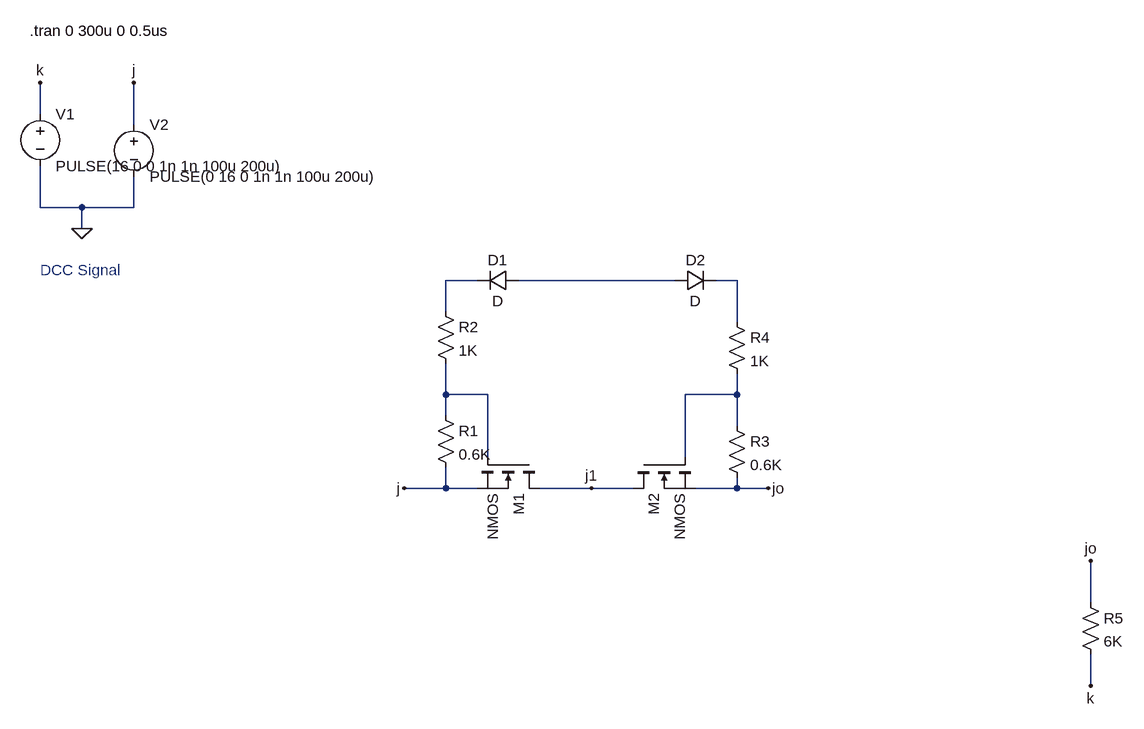
[diagram p0: schematic dccAbc.asc]
dccAbc.asc, the LTspice schematic file:
Version 4
SHEET 1 880 680
WIRE -1856 -688 -1856 -736
WIRE -1712 -672 -1712 -736
WIRE -1856 -544 -1856 -608
WIRE -1792 -544 -1856 -544
WIRE -1712 -544 -1712 -592
WIRE -1712 -544 -1792 -544
WIRE -1792 -512 -1792 -544
WIRE -1184 -432 -1232 -432
WIRE -880 -432 -1120 -432
WIRE -784 -432 -816 -432
WIRE -1232 -384 -1232 -432
WIRE -784 -368 -784 -432
WIRE -1232 -256 -1232 -304
WIRE -1168 -256 -1232 -256
WIRE -784 -256 -784 -288
WIRE -784 -256 -864 -256
WIRE -1232 -224 -1232 -256
WIRE -784 -208 -784 -256
WIRE -1168 -160 -1168 -256
WIRE -864 -160 -864 -256
WIRE -1232 -112 -1232 -144
WIRE -1232 -112 -1296 -112
WIRE -1184 -112 -1232 -112
WIRE -1008 -112 -1088 -112
WIRE -944 -112 -1008 -112
WIRE -784 -112 -784 -128
WIRE -784 -112 -848 -112
WIRE -736 -112 -784 -112
WIRE -240 64 -240 0
WIRE -240 192 -240 144
FLAG -1792 -512 0
FLAG -1712 -736 j
FLAG -1856 -736 k
FLAG -1296 -112 j
FLAG -1008 -112 j1
FLAG -736 -112 jo
FLAG -240 0 jo
FLAG -240 192 k
SYMBOL voltage -1712 -688 R0
SYMATTR InstName V2
SYMATTR Value PULSE(0 16 0 1n 1n 100u 200u)
SYMBOL voltage -1856 -704 R0
SYMATTR InstName V1
SYMATTR Value PULSE(16 0 0 1n 1n 100u 200u)
SYMBOL nmos -1088 -160 R90
SYMATTR InstName M1
SYMBOL nmos -944 -160 M90
SYMATTR InstName M2
SYMBOL res -1248 -240 R0
SYMATTR InstName R1
SYMATTR Value 0.6K
SYMBOL res -1248 -400 R0
SYMATTR InstName R2
SYMATTR Value 1K
SYMBOL res -800 -224 R0
SYMATTR InstName R3
SYMATTR Value 0.6K
SYMBOL res -800 -384 R0
SYMATTR InstName R4
SYMATTR Value 1K
SYMBOL diode -1120 -448 R90
WINDOW 0 0 32 VBottom 2
WINDOW 3 32 32 VTop 2
SYMATTR InstName D1
SYMBOL diode -880 -448 M90
WINDOW 0 0 32 VBottom 2
WINDOW 3 32 32 VTop 2
SYMATTR InstName D2
SYMBOL res -256 48 R0
SYMATTR InstName R5
SYMATTR Value 6K
TEXT -1872 -816 Left 2 !.tran 0 300u 0 0.5us
TEXT -1856 -448 Left 2 ;DCC Signal

The netlist it stands for:
* dccAbc.asc
V2 j 0 PULSE(0 16 0 1n 1n 100u 200u)
V1 k 0 PULSE(16 0 0 1n 1n 100u 200u)
M1 j1 N004 j j NMOS
M2 j1 N005 jo jo NMOS
R1 N004 j 0.6K
R2 N001 N004 1K
R3 N005 jo 0.6K
R4 N003 N005 1K
D1 N002 N001 D
D2 N002 N003 D
R5 jo k 6K
.model D D
.lib standard.dio
.model NMOS NMOS
.model PMOS PMOS
.lib standard.mos
.tran 0 300u 0 0.5us
* DCC Signal
.backanno
.end